# EAGLE design BLE113_breakout (EAGLE 7.1.0)
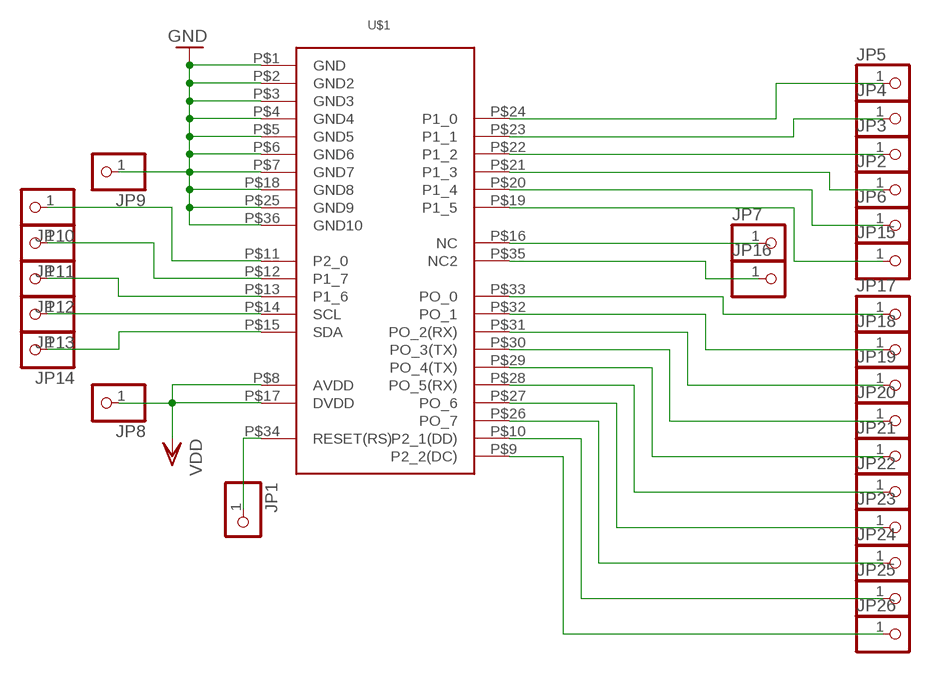
[diagram p0: schematic, sheet 1]

## Parts
JP1  PINHD-1X1  [1X01]
JP2  PINHD-1X1  [1X01]
JP3  PINHD-1X1  [1X01]
JP4  PINHD-1X1  [1X01]
JP5  PINHD-1X1  [1X01]
JP6  PINHD-1X1  [1X01]
JP7  PINHD-1X1  [1X01]
JP8  PINHD-1X1  [1X01]
JP9  PINHD-1X1  [1X01]
JP10  PINHD-1X1  [1X01]
JP11  PINHD-1X1  [1X01]
JP12  PINHD-1X1  [1X01]
JP13  PINHD-1X1  [1X01]
JP14  PINHD-1X1  [1X01]
JP15  PINHD-1X1  [1X01]
JP16  PINHD-1X1  [1X01]
JP17  PINHD-1X1  [1X01]
JP18  PINHD-1X1  [1X01]
JP19  PINHD-1X1  [1X01]
JP20  PINHD-1X1  [1X01]
JP21  PINHD-1X1  [1X01]
JP22  PINHD-1X1  [1X01]
JP23  PINHD-1X1  [1X01]
JP24  PINHD-1X1  [1X01]
JP25  PINHD-1X1  [1X01]
JP26  PINHD-1X1  [1X01]
U$1  BLE113-A  [BLUETOOTHNS]

## Nets
GND: JP9.1 U$1.P$1(GND) U$1.P$2(GND2) U$1.P$3(GND3) U$1.P$4(GND4) U$1.P$5(GND5) U$1.P$6(GND6) U$1.P$7(GND7) U$1.P$18(GND8) U$1.P$25(GND9) U$1.P$36(GND10)
N$1: JP5.1 U$1.P$24(P1_0)
N$2: JP4.1 U$1.P$23(P1_1)
N$3: JP3.1 U$1.P$22(P1_2)
N$4: JP2.1 U$1.P$21(P1_3)
N$5: JP6.1 U$1.P$20(P1_4)
N$6: JP15.1 U$1.P$19(P1_5)
N$7: JP1.1 U$1.P$34(RESET(RS))
N$8: JP7.1 U$1.P$16(NC)
N$9: JP16.1 U$1.P$35(NC2)
N$10: JP17.1 U$1.P$33(PO_0)
N$11: JP18.1 U$1.P$32(PO_1)
N$12: JP19.1 U$1.P$31(PO_2(RX))
N$13: JP20.1 U$1.P$30(PO_3(TX))
N$14: JP21.1 U$1.P$29(PO_4(TX))
N$15: JP22.1 U$1.P$28(PO_5(RX))
N$16: JP23.1 U$1.P$27(PO_6)
N$17: JP24.1 U$1.P$26(PO_7)
N$18: JP25.1 U$1.P$10(P2_1(DD))
N$19: JP26.1 U$1.P$9(P2_2(DC))
N$20: JP10.1 U$1.P$11(P2_0)
N$21: JP11.1 U$1.P$12(P1_7)
N$22: JP12.1 U$1.P$13(P1_6)
N$23: JP13.1 U$1.P$14(SCL)
N$24: JP14.1 U$1.P$15(SDA)
VDD: JP8.1 U$1.P$8(AVDD) U$1.P$17(DVDD)

## Library data of the parts
JP1-JP26 = pinhead:PINHD-1X1: PIN HEADER
U$1 = BitFit:BLE113-A

## Board
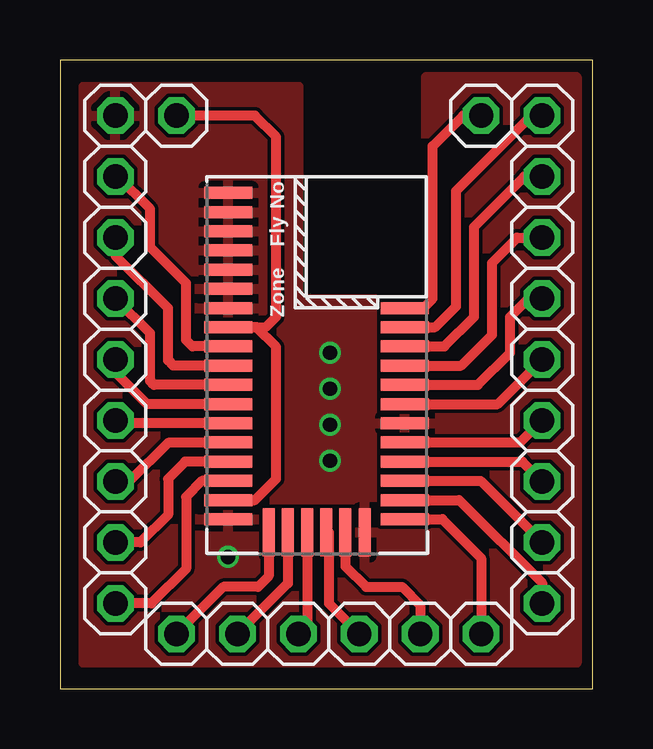
[diagram p1: board, top side]
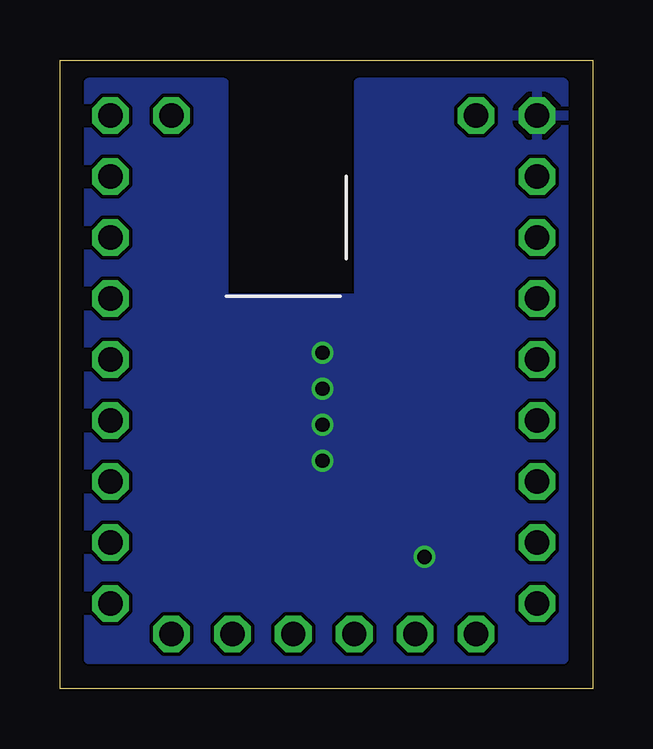
[diagram p2: board, bottom side, seen from below]

Size 22.19 x 26.2 mm. Coordinates in mm from the lower left corner, seen from the top.
Outline: 0,0 22.19,0 22.19,26.2 0,26.2 0,0
Copper layers (1*16): Top 0.035mm / dielectric 1.5mm / Bottom 0.035mm
Design rules "ITead_rule *": minimum track width 6mil, minimum drill 12mil, track to track 6mil, track to pad 6mil, pad to pad 6mil, via to via 6mil, smd to smd 0mil, copper to edge 10mil, drill to drill 10mil, minimum pad ring 10mil, minimum via ring 6mil, stop-mask expansion 2mil, vias tented up to drill 100mil, thermal gap 10mil

### Footprints (pad centres in the part's own frame; a part is rotated, then mirrored left to right if it is on the bottom)
1X01 = drill 1.016 octagon: 1 0,0
BLUETOOTHNS = smd 2 x 0.5: P$1 0.9,-0.675; P$2 0.9,-1.475; P$3 0.9,-2.275; P$4 0.9,-3.075; P$5 0.9,-3.875; P$6 0.9,-4.675; P$7 0.9,-5.475; P$8 0.9,-6.275; P$9 0.9,-7.075; P$10 0.9,-7.875; P$11 0.9,-8.675; P$12 0.9,-9.475; P$13 0.9,-10.275; P$14 0.9,-11.075; P$15 0.9,-11.875; P$16 0.9,-12.675; P$17 0.9,-13.475; P$18 0.9,-14.275; P$19 8.25,-5.475; P$20 8.25,-6.275; P$21 8.25,-7.075; P$22 8.25,-7.875; P$23 8.25,-8.675; P$24 8.25,-9.475; P$25 8.25,-10.275; P$26 8.25,-11.075; P$27 8.25,-11.875; P$28 8.25,-12.675; P$29 8.25,-13.475; P$30 8.25,-14.275 | smd 0.5 x 2: P$31 2.575,-14.825; P$32 3.375,-14.825; P$33 4.175,-14.825; P$34 4.975,-14.825; P$35 5.775,-14.825; P$36 6.575,-14.825

### Placement (x,y rotation side)
JP1  12.47,2.29 0 top
JP2  20.09,21.34 0 top
JP3  20.09,18.8 0 top
JP4  20.09,16.26 0 top
JP5  20.09,13.72 0 top
JP6  20.09,23.88 0 top
JP7  2.31,3.56 0 top
JP8  4.85,23.88 0 top
JP9  2.31,23.88 0 top
JP10  2.31,16.26 0 top
JP11  2.31,13.72 0 top
JP12  2.31,11.18 0 top
JP13  2.31,8.64 0 top
JP14  2.31,6.1 0 top
JP15  17.55,23.88 0 top
JP16  15.01,2.29 0 top
JP17  9.93,2.29 0 top
JP18  7.39,2.29 0 top
JP19  4.85,2.29 0 top
JP20  17.55,2.29 0 top
JP21  20.09,3.56 0 top
JP22  20.09,6.1 0 top
JP23  20.09,8.64 0 top
JP24  20.09,11.18 0 top
JP25  2.31,18.8 0 top
JP26  2.31,21.34 0 top
U$1  6.12,21.34 0 top

### Tracks (layer width: path | path; a pad name or v marks a point on that pad's centre or on a via)
GND  (via drill 0.6)
  other vias: 7,5.5 11.25,14 11.25,12.5 11.25,11 11.25,9.5
  pour Top: 0.98,25.09 9.93,25.09 9.93,16.26 15.25,16.25 15.25,25.5 21.53,25.5 21.53,1.08 0.98,1.08
  pour Bottom: 1.21,25.25 9.75,25.25 9.75,16.25 15.37,16.25 15.37,25.25 21,25.25 21,1.25 1.21,1.25
N$1
  Top 0.406: U$1.P$24 18.23,11.87 JP5.1
N$2
  Top 0.406: U$1.P$23 17.41,12.66 18.75,14 18.75,15.5 19.51,16.26 JP4.1
N$3
  Top 0.406: U$1.P$22 16.71,13.46 18,14.75 18,17.75 19.05,18.8 JP3.1
N$4
  Top 0.406: U$1.P$21 16.02,14.27 17.25,15.5 17.25,19.25 19.34,21.34 JP2.1
N$5
  Top 0.406: U$1.P$20 15.63,15.06 16.5,15.93 16.5,20.75 19.63,23.88 JP6.1
N$6
  Top 0.406: U$1.P$19 15.13,15.87 15.53,16.26 15.53,22.61 16.8,23.88 JP15.1
N$7
  Top 0.406: U$1.P$34 11.2,6.51 11.2,3.56 JP1.1
N$8
  Top 0.406: U$1.P$16 5.92,8.66 5.25,8 5.25,5 3.81,3.56 JP7.1
N$9
  Top 0.406: U$1.P$35 11.89,5.11 12.75,4.25 14.25,4.25 15.01,3.49 JP16.1
N$10
  Top 0.406: U$1.P$33 10.29,2.65 JP17.1
N$11
  Top 0.406: U$1.P$32 9.49,4.39 JP18.1
N$12
  Top 0.406: U$1.P$31 8.7,4.7 8.25,4.25 6.81,4.25 JP19.1
N$13
  Top 0.406: U$1.P$30 15.94,7.07 17.55,5.45 JP20.1
N$14
  Top 0.406: U$1.P$29 16.64,7.87 20.09,4.41 JP21.1
N$15
  Top 0.406: U$1.P$28 17.52,8.66 JP22.1
N$16
  Top 0.406: U$1.P$27 19.27,9.46 JP23.1
N$17
  Top 0.406: U$1.P$26 19.18,10.27 JP24.1
N$18
  Top 0.406: U$1.P$10 4.71,13.46 4.5,13.68 4.5,15.86 2.31,18.05 JP25.1
N$19
  Top 0.406: U$1.P$9 5.51,14.27 5.25,14.53 5.25,16.9 3.75,18.4 3.75,20 2.41,21.34 JP26.1
N$20
  Top 0.406: U$1.P$11 3.92,12.66 3.75,12.83 3.75,14.82 JP10.1
N$21
  Top 0.406: U$1.P$12 3.63,11.87 2.31,13.19 JP11.1
N$22
  Top 0.406: U$1.P$13 2.42,11.06 JP12.1
N$23
  Top 0.406: U$1.P$14 7,10.25 4.5,10.25 2.89,8.64 JP13.1
N$24
  Top 0.406: U$1.P$15 5.21,9.46 4.5,8.75 4.5,7.25 3.35,6.1 JP14.1
VDD
  Top 0.406: U$1.P$17 8.12,7.87 9,8.75 9,14.25 8.19,15.06 U$1.P$8 8.56,15.06 9,15.5 9,23 8.12,23.88 JP8.1